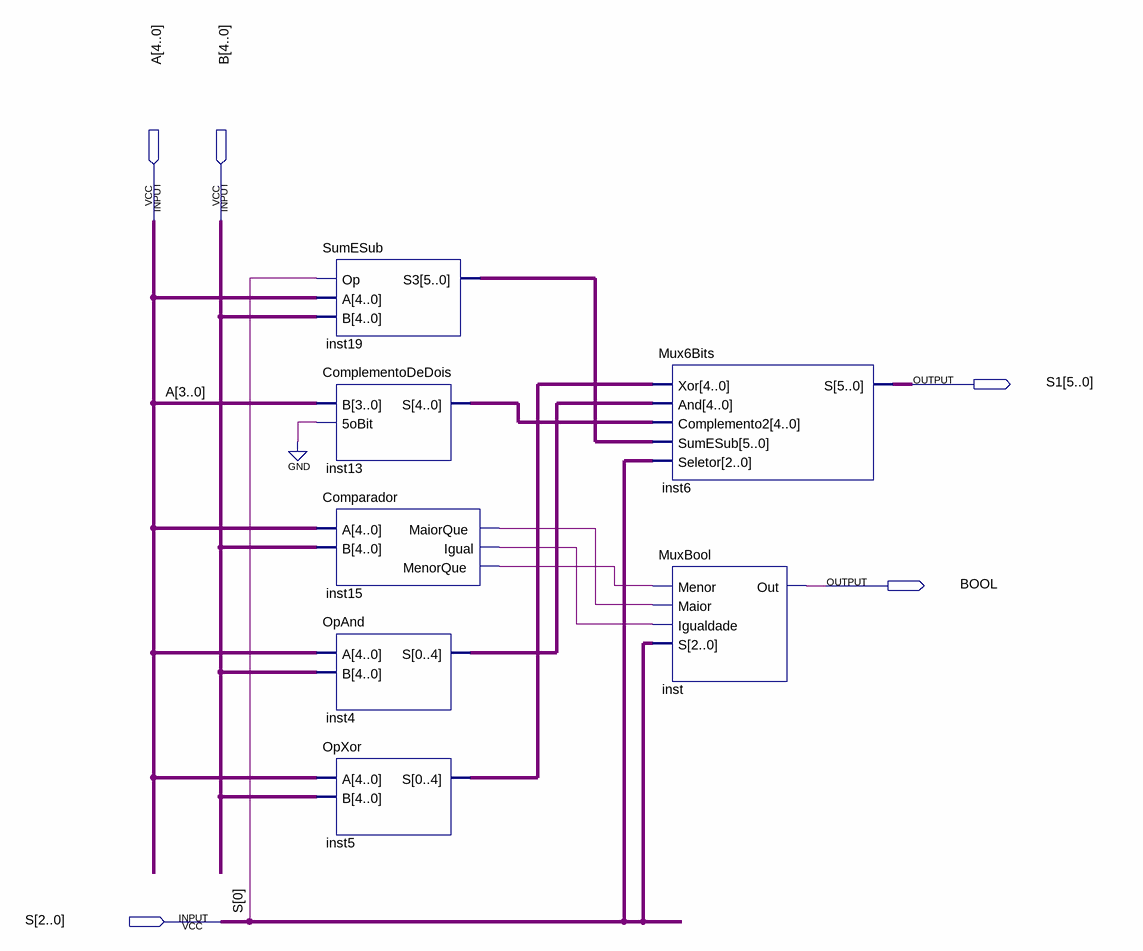
[diagram p0: schematic sheet]
// Quartus schematic Geral.bdf as structural Verilog: 7 symbols, 5 pins
module Geral (
  input  [4:0] A,
  input  [4:0] B,
  input  [2:0] S,
  output [5:0] S1,
  output BOOL
);

  wire inst15_igual, inst15_maiorque, inst15_menorque;
  wire [4:0] inst4_s, inst5_s, inst13_s;
  wire [5:0] inst19_s3;

  SumESub inst19 (.Op(S[0]), .A(A), .B(B), .S3(inst19_s3));
  ComplementoDeDois inst13 (.B(A[3:0]), .\5oBit (1'b0), .S(inst13_s));
  Comparador inst15 (.A(A), .B(B), .MaiorQue(inst15_maiorque), .Igual(inst15_igual), .MenorQue(inst15_menorque));
  OpAnd inst4 (.A(A), .B(B), .S(inst4_s));
  OpXor inst5 (.A(A), .B(B), .S(inst5_s));
  Mux6Bits inst6 (.Xor(inst5_s), .And(inst4_s), .Complemento2(inst13_s), .SumESub(inst19_s3), .Seletor(S), .S(S1));
  MuxBool inst (.Menor(inst15_menorque), .Maior(inst15_maiorque), .Igualdade(inst15_igual), .S(S), .Out(BOOL));
endmodule
